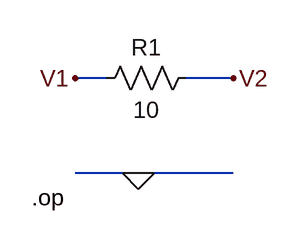
[diagram p0: schematic ejemplo3.asc]
ejemplo3.asc, the LTspice schematic file:
Version 4
SHEET 1 880 680
WIRE 160 96 128 96
WIRE 288 96 240 96
WIRE 192 192 128 192
WIRE 288 192 192 192
FLAG 192 192 0
FLAG 128 96 V1
FLAG 288 96 V2
SYMBOL res 256 80 R90
WINDOW 0 0 56 VBottom 2
WINDOW 3 32 56 VTop 2
SYMATTR InstName R1
SYMATTR Value 10
TEXT 84 216 Left 2 !.op

The netlist it stands for:
* ejemplo3.asc
R1 V2 V1 10
.op
.backanno
.end